# EAGLE design RB3200-ESP32universal (EAGLE 7.7.0)
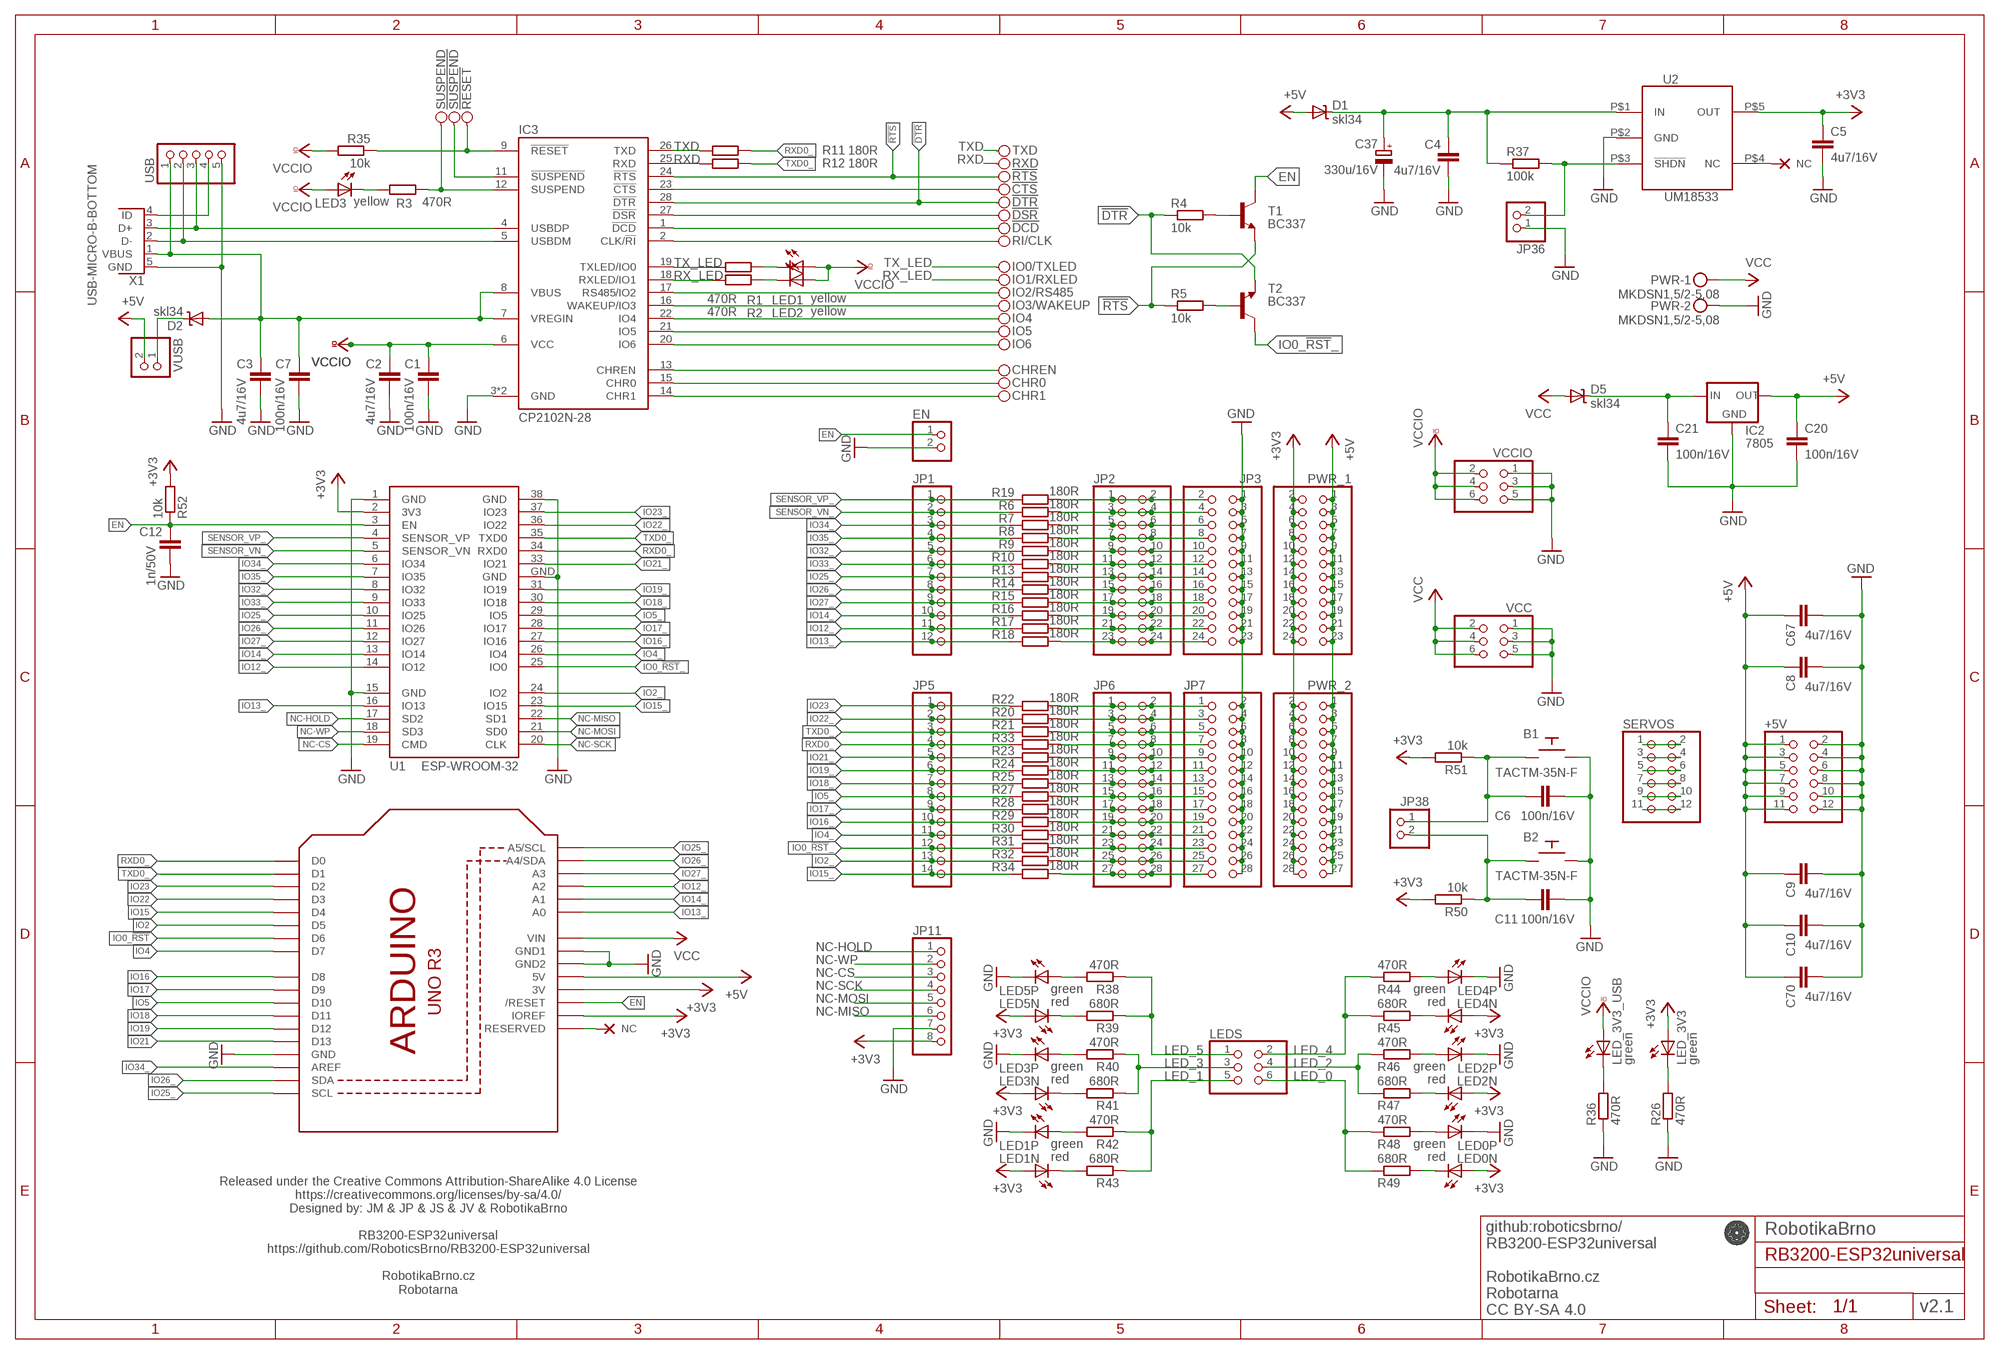
[diagram p0: schematic, sheet 1]

## Parts
!CTS  PINH1X01  [1X01]
!DCD  PINH1X01  [1X01]
!DSR  PINH1X01  [1X01]
!DTR  PINH1X01  [1X01]
!RESET  PINH1X01  [1X01]
!RTS  PINH1X01  [1X01]
!SUSPEND  PINH1X01  [1X01]
+5V  PINHD-2X6  [2X06]
B1  TACTM-35N-F  [TACTM-35N-F]
B2  TACTM-35N-F  [TACTM-35N-F]
C1  100n/16V  C-EUC0402  [C0402]
C2  4u7/16V  C-EUC0603  [C0603]
C3  4u7/16V  C-EUC0603  [C0603]
C4  4u7/16V  C-EUC0603  [C0603]
C5  4u7/16V  C-EUC0603  [C0603]
C6  100n/16V  C-EUC0402  [C0402]
C7  100n/16V  C-EUC0402  [C0402]
C8  4u7/16V  C-EUC0805  [C0805]
C9  4u7/16V  C-EUC0805  [C0805]
C10  4u7/16V  C-EUC0805  [C0805]
C11  100n/16V  C-EUC0402  [C0402]
C12  1n/50V  C-EUC0603  [C0603]
C20  100n/16V  C-EUC0402  [C0402]
C21  100n/16V  C-EUC0402  [C0402]
C37  330u/16V  CPOL-EUE5-10.5  [E5-10,5]
C67  4u7/16V  C-EUC0805  [C0805]
C70  4u7/16V  C-EUC0805  [C0805]
CHR0  PINH1X01  [1X01]
CHR1  PINH1X01  [1X01]
CHREN  PINH1X01  [1X01]
D1  skl34  SHOTTKY-SOD123  [SOD123]
D2  skl34  SHOTTKY-SOD123  [SOD123]
D5  skl34  SHOTTKY-SOD123  [SOD123]
EN  PINHD-1X2  [1X02]
IC2  7805  78XXS  [78XXS]
IC3  CP2102N-28  [QFN28-PAD]
IO0/TXLED  PINH1X01  [1X01]
IO1/RXLED  PINH1X01  [1X01]
IO2/RS485  PINH1X01  [1X01]
IO3/WAKEUP  PINH1X01  [1X01]
IO4  PINH1X01  [1X01]
IO5  PINH1X01  [1X01]
IO6  PINH1X01  [1X01]
JP1  PINHD-1X12  [1X12]
JP2  PINHD-2X12  [2X12]
JP3  PINHD-2X12  [2X12]
JP5  PINHD-1X14  [1X14]
JP6  PINHD-2X14  [2X14]
JP7  PINHD-2X14  [2X14]
JP11  PINHD-1X8  [1X08]
JP36  PINHD-1X2  [1X02]
JP38  PINHD-1X2  [1X02]
LED0N  red  LEDCHIPLED_0603  [CHIPLED_0603]
LED0P  green  LEDCHIPLED_0603  [CHIPLED_0603]
LED1  yellow  LEDCHIP-LED0603  [CHIP-LED0603]
LED1N  red  LEDCHIPLED_0603  [CHIPLED_0603]
LED1P  green  LEDCHIPLED_0603  [CHIPLED_0603]
LED2  yellow  LEDCHIP-LED0603  [CHIP-LED0603]
LED2N  red  LEDCHIPLED_0603  [CHIPLED_0603]
LED2P  green  LEDCHIPLED_0603  [CHIPLED_0603]
LED3  yellow  LEDCHIP-LED0603  [CHIP-LED0603]
LED3N  red  LEDCHIPLED_0603  [CHIPLED_0603]
LED3P  green  LEDCHIPLED_0603  [CHIPLED_0603]
LED4N  red  LEDCHIPLED_0603  [CHIPLED_0603]
LED4P  green  LEDCHIPLED_0603  [CHIPLED_0603]
LED5N  red  LEDCHIPLED_0603  [CHIPLED_0603]
LED5P  green  LEDCHIPLED_0603  [CHIPLED_0603]
LED_3V3  green  LEDCHIPLED_0603  [CHIPLED_0603]
LED_3V3_USB  green  LEDCHIPLED_0603  [CHIPLED_0603]
LEDS  PINHD-2X3  [2X03]
NC3  NC  (no package)
NC28  NC  (no package)
PWR  MKDSN1,5/2-5,08  [MKDSN1,5/2-5,08]
PWR_1  PINHD-2X12  [2X12]
PWR_2  PINHD-2X14  [2X14]
R1  470R  R-EU_R0603  [R0603]
R2  470R  R-EU_R0603  [R0603]
R3  470R  R-EU_R0603  [R0603]
R4  10k  R-EU_R0603  [R0603]
R5  10k  R-EU_R0603  [R0603]
R6  180R  R-EU_R0603  [R0603]
R7  180R  R-EU_R0603  [R0603]
R8  180R  R-EU_R0603  [R0603]
R9  180R  R-EU_R0603  [R0603]
R10  180R  R-EU_R0603  [R0603]
R11  180R  R-EU_R0603  [R0603]
R12  180R  R-EU_R0603  [R0603]
R13  180R  R-EU_R0603  [R0603]
R14  180R  R-EU_R0603  [R0603]
R15  180R  R-EU_R0603  [R0603]
R16  180R  R-EU_R0603  [R0603]
R17  180R  R-EU_R0603  [R0603]
R18  180R  R-EU_R0603  [R0603]
R19  180R  R-EU_R0603  [R0603]
R20  180R  R-EU_R0603  [R0603]
R21  180R  R-EU_R0603  [R0603]
R22  180R  R-EU_R0603  [R0603]
R23  180R  R-EU_R0603  [R0603]
R24  180R  R-EU_R0603  [R0603]
R25  180R  R-EU_R0603  [R0603]
R26  470R  R-EU_R0603  [R0603]
R27  180R  R-EU_R0603  [R0603]
R28  180R  R-EU_R0603  [R0603]
R29  180R  R-EU_R0603  [R0603]
R30  180R  R-EU_R0603  [R0603]
R31  180R  R-EU_R0603  [R0603]
R32  180R  R-EU_R0603  [R0603]
R33  180R  R-EU_R0603  [R0603]
R34  180R  R-EU_R0603  [R0603]
R35  10k  R-EU_R0603  [R0603]
R36  470R  R-EU_R0603  [R0603]
R37  100k  R-EU_R0603  [R0603]
R38  470R  R-EU_R0603  [R0603]
R39  680R  R-EU_R0603  [R0603]
R40  470R  R-EU_R0603  [R0603]
R41  680R  R-EU_R0603  [R0603]
R42  470R  R-EU_R0603  [R0603]
R43  680R  R-EU_R0603  [R0603]
R44  470R  R-EU_R0603  [R0603]
R45  680R  R-EU_R0603  [R0603]
R46  470R  R-EU_R0603  [R0603]
R47  680R  R-EU_R0603  [R0603]
R48  470R  R-EU_R0603  [R0603]
R49  680R  R-EU_R0603  [R0603]
R50  10k  R-EU_R0603  [R0603]
R51  10k  R-EU_R0603  [R0603]
R52  10k  R-EU_R0603  [R0603]
RI/CLK  PINH1X01  [1X01]
RXD  PINH1X01  [1X01]
SERVOS  PINHD-2X6  [2X06]
SUSPEND  PINH1X01  [1X01]
T1  BC337  NPN-SOT23-BEC  [SOT23]
T2  BC337  NPN-SOT23-BEC  [SOT23]
TXD  PINH1X01  [1X01]
U1  ESP-WROOM-32  [ESP-WROOM-32]
U2  UM18533  UM185XX  [SOT23-5]
U3  ARDUINOR3-BPLACE  [ARDUINOR3-BPLACE]
USB  PINHD-1X5  [1X05]
VCC  PINHD-2X3  [2X03]
VCCIO  PINHD-2X3  [2X03]
VUSB  PINHD-1X2  [1X02]
X1  USB-MICRO-B-BOTTOM  [USB-MICRO-B-BOTTOM-MOLEX]

## Nets
3V3_IN: C4.1 C37.+ D1.C R37.1 U2.P$1(IN)
5V_USB: D2.C VUSB.1
!DTR: !DTR.1 IC3.28(!DTR) R4.1 T2.2(E)
!DTR_B: R4.2 T1.1(B)
!RESET: !RESET.1 IC3.9(!RESET) R35.1
!RTS: !RTS.1 IC3.24(!RTS) R5.1 T1.2(E)
!RTS_B: R5.2 T2.1(B)
!SHDN: JP36.2 R37.2 U2.P$3(!SHDN)
!SUSPEND: !SUSPEND.1 IC3.11(!SUSPEND)
+3V3: C5.1 JP11.8 LED0N.A LED1N.A LED2N.A LED3N.A LED4N.A LED5N.A LED_3V3.A PWR_1.2 PWR_1.4 PWR_1.6 PWR_1.8 PWR_1.10 PWR_1.12 PWR_1.14 PWR_1.16 PWR_1.18 PWR_1.20 PWR_1.22 PWR_1.24 PWR_2.2 PWR_2.4 PWR_2.6 PWR_2.8 PWR_2.10 PWR_2.12 PWR_2.14 PWR_2.16 PWR_2.18 PWR_2.20 PWR_2.22 PWR_2.24 PWR_2.26 PWR_2.28 R50.2 R51.2 R52.2 U1.2(3V3) U2.P$5(OUT) U3.3V U3.IOREF
+5V: +5V.1 +5V.3 +5V.5 +5V.7 +5V.9 +5V.11 C8.1 C9.1 C10.1 C20.1 C67.1 C70.1 D1.A IC2.OUT PWR_1.1 PWR_1.3 PWR_1.5 PWR_1.7 PWR_1.9 PWR_1.11 PWR_1.13 PWR_1.15 PWR_1.17 PWR_1.19 PWR_1.21 PWR_1.23 PWR_2.1 PWR_2.3 PWR_2.5 PWR_2.7 PWR_2.9 PWR_2.11 PWR_2.13 PWR_2.15 PWR_2.17 PWR_2.19 PWR_2.21 PWR_2.23 PWR_2.25 PWR_2.27 U3.5V VUSB.2
BTN0: B1.P$4 C6.2 JP38.1 R51.1
BTN1: B2.P$4 C11.2 JP38.2 R50.1
CHR0: CHR0.1 IC3.15(CHR0)
CHR1: CHR1.1 IC3.14(CHR1)
CHREN: CHREN.1 IC3.13(CHREN)
CLK/!RI: IC3.2(CLK/!RI) RI/CLK.1
DCD: !DCD.1 IC3.1(!DCD)
DM: IC3.5(USBDM) USB.2 X1.2(D-)
DP: IC3.4(USBDP) USB.3 X1.3(D+)
DSR: !DSR.1 IC3.27(!DSR)
EN: C12.1 EN.1 R52.1 T1.3(C) U1.3(EN) U3.RESET(/RESET)
GND: +5V.2 +5V.4 +5V.6 +5V.8 +5V.10 +5V.12 B1.P$2 B2.P$2 C1.2 C2.2 C3.2 C4.2 C5.2 C6.1 C7.2 C8.2 C9.2 C10.2 C11.1 C12.2 C20.2 C21.2 C37.- C67.2 C70.2 EN.2 IC2.GND IC3.3(GND) IC3.PAD(GND) JP3.1 JP3.3 JP3.5 JP3.7 JP3.9 JP3.11 JP3.13 JP3.15 JP3.17 JP3.19 JP3.21 JP3.23 JP7.2 JP7.4 JP7.6 JP7.8 JP7.10 JP7.12 JP7.14 JP7.16 JP7.18 JP7.20 JP7.22 JP7.24 JP7.26 JP7.28 JP11.7 JP36.1 LED0P.C LED1P.C LED2P.C LED3P.C LED4P.C LED5P.C PWR.2 R26.1 R36.1 U1.1(GND) U1.15(GND) U1.38(GND) U1.GND U2.P$2(GND) U3.GND U3.GND1 U3.GND2 USB.5 VCC.1 VCC.3 VCC.5 VCCIO.1 VCCIO.3 VCCIO.5 X1.5(GND)
IO0_!RST: JP6.23 JP6.24 JP7.23 R31.1 U3.D6
IO0_!RST!_: JP5.12 R31.2 T2.3(C) U1.25(IO0)
IO2: JP6.25 JP6.26 JP7.25 R32.1 U3.D5
IO2_: JP5.13 R32.2 U1.24(IO2)
IO4: JP6.21 JP6.22 JP7.21 R30.1 U3.D7
IO4_: JP5.11 R30.2 U1.26(IO4)
IO5: JP6.15 JP6.16 JP7.15 R27.1 U3.D10
IO5_: JP5.8 R27.2 U1.29(IO5)
IO12: JP2.21 JP2.22 JP3.22 R17.1
IO12_: JP1.11 R17.2 U1.14(IO12) U3.A2
IO13: JP2.23 JP2.24 JP3.24 R18.1
IO13_: JP1.12 R18.2 U1.16(IO13) U3.A0
IO14: JP2.19 JP2.20 JP3.20 R16.1
IO14_: JP1.10 R16.2 U1.13(IO14) U3.A1
IO15: JP6.27 JP6.28 JP7.27 R34.1 U3.D4
IO15_: JP5.14 R34.2 U1.23(IO15)
IO16: JP6.19 JP6.20 JP7.19 R29.1 U3.D8
IO16_: JP5.10 R29.2 U1.27(IO16)
IO17: JP6.17 JP6.18 JP7.17 R28.1 U3.D9
IO17_: JP5.9 R28.2 U1.28(IO17)
IO18: JP6.13 JP6.14 JP7.13 R25.1 U3.D11
IO18_: JP5.7 R25.2 U1.30(IO18)
IO19: JP6.11 JP6.12 JP7.11 R24.1 U3.D12
IO19_: JP5.6 R24.2 U1.31(IO19)
IO21: JP6.9 JP6.10 JP7.9 R23.1 U3.D13
IO21_: JP5.5 R23.2 U1.33(IO21)
IO22: JP6.3 JP6.4 JP7.3 R20.1 U3.D3
IO22_: JP5.2 R20.2 U1.36(IO22)
IO23: JP6.1 JP6.2 JP7.1 R22.1 U3.D2
IO23_: JP5.1 R22.2 U1.37(IO23)
IO25: JP2.13 JP2.14 JP3.14 R13.1
IO25_: JP1.7 R13.2 U1.10(IO25) U3.A5(A5/SCL) U3.SCL
IO26: JP2.15 JP2.16 JP3.16 R14.1
IO26_: JP1.8 R14.2 U1.11(IO26) U3.A4(A4/SDA) U3.SDA
IO27: JP2.17 JP2.18 JP3.18 R15.1
IO27_: JP1.9 R15.2 U1.12(IO27) U3.A3
IO32: JP2.9 JP2.10 JP3.10 R9.1
IO32_: JP1.5 R9.2 U1.8(IO32)
IO33: JP2.11 JP2.12 JP3.12 R10.1
IO33_: JP1.6 R10.2 U1.9(IO33)
IO34: JP2.5 JP2.6 JP3.6 R7.1
IO34_: JP1.3 R7.2 U1.6(IO34) U3.AREF
IO35: JP2.7 JP2.8 JP3.8 R8.1
IO35_: JP1.4 R8.2 U1.7(IO35)
LED0N: LED0N.C R49.2
LED0P: LED0P.A R48.2
LED1N: LED1N.C R43.2
LED1P: LED1P.A R42.2
LED2N: LED2N.C R47.2
LED2P: LED2P.A R46.2
LED3N: LED3N.C R41.2
LED3P: LED3P.A R40.2
LED4N: LED4N.C R45.2
LED4P: LED4P.A R44.2
LED5N: LED5N.C R39.2
LED5P: LED5P.A R38.2
LED_0: LEDS.6 R48.1 R49.1
LED_1: LEDS.5 R42.1 R43.1
LED_2: LEDS.4 R46.1 R47.1
LED_3: LEDS.3 R40.1 R41.1
LED_3V3: LED_3V3.C R26.2
LED_3V3_USB: LED_3V3_USB.C R36.2
LED_4: LEDS.2 R44.1 R45.1
LED_5: LEDS.1 R38.1 R39.1
N$1: NC28.NC U3.RESERVED
N$2: !CTS.1 IC3.23(!CTS)
N$3: U3.VIN ; supply symbol labelled VCC
N$4: LED3.C R3.2
N$31: SERVOS.1 SERVOS.2
N$32: SERVOS.3 SERVOS.4
N$33: SERVOS.5 SERVOS.6
N$34: SERVOS.7 SERVOS.8
N$35: SERVOS.9 SERVOS.10
N$36: SERVOS.11 SERVOS.12
NC-CS: JP11.3 U1.19(CMD)
NC-HOLD: JP11.1 U1.17(SD2)
NC-MISO: JP11.6 U1.22(SD1)
NC-MOSI: JP11.5 U1.21(SD0)
NC-SCK: JP11.4 U1.20(CLK)
NC-WP: JP11.2 U1.18(SD3)
RX-LED: LED2.C R2.1
RX_LED: IC3.18(RXLED/IO1) IO1/RXLED.1 R2.2
RXD: IC3.25(RXD) R12.1 RXD.1
RXD0: JP6.7 JP6.8 JP7.7 R33.1 U3.D0
RXD0_: JP5.4 R11.2 R33.2 U1.34(RXD0)
SENSOR_VN: JP2.3 JP2.4 JP3.4 R6.1
SENSOR_VN_: JP1.2 R6.2 U1.5(SENSOR_VN)
SENSOR_VP: JP2.1 JP2.2 JP3.2 R19.1
SENSOR_VP_: JP1.1 R19.2 U1.4(SENSOR_VP)
SUSPEND: IC3.12(SUSPEND) R3.1 SUSPEND.1
TX-LED: LED1.C R1.1
TX_LED: IC3.19(TXLED/IO0) IO0/TXLED.1 R1.2
TXD: IC3.26(TXD) R11.1 TXD.1
TXD0: JP6.5 JP6.6 JP7.5 R21.1 U3.D1
TXD0_: JP5.3 R12.2 R21.2 U1.35(TXD0)
U2_NC: NC3.NC U2.P$4(NC)
USBID: USB.4 X1.4(ID)
USBIO3_RS485: IC3.17(RS485/IO2) IO2/RS485.1
USBIO3_WAKEUP: IC3.16(WAKEUP/IO3) IO3/WAKEUP.1
USBIO4: IC3.22(IO4) IO4.1
USBIO5: IC3.21(IO5) IO5.1
USBIO6: IC3.20(IO6) IO6.1
VCC: D5.A PWR.1 VCC.2 VCC.4 VCC.6
VCC->5V: C21.1 D5.C IC2.IN
VCCIO: C1.1 C2.1 IC3.6(VCC) LED1.A LED2.A LED3.A LED_3V3_USB.A R35.2 VCCIO.2 VCCIO.4 VCCIO.6
VUSB: C3.1 C7.1 D2.A IC3.7(VREGIN) IC3.8(VBUS) USB.1 X1.1(VBUS)

## Notes on the sheet
- Released under the Creative Commons Attribution-ShareAlike 4.0 License
  https://creativecommons.org/licenses/by-sa/4.0/
  Designed by: JM & JP & JS & JV & RobotikaBrno
  
  RB3200-ESP32universal
  https://github.com/RoboticsBrno/RB3200-ESP32universal
  
  RobotikaBrno.cz
  Robotarna
- RobotikaBrno
- v2.1
- github:roboticsbrno/
  RB3200-ESP32universal
  
  RobotikaBrno.cz
  Robotarna
  CC BY-SA 4.0

## Library data of the parts
!CTS !DCD !DSR !DTR !RESET !RTS !SUSPEND CHR0 CHR1 CHREN IO0/TXLED IO1/RXLED IO2/RS485 IO3/WAKEUP IO4-IO6 RI/CLK RXD SUSPEND TXD = pinhead_smd:PINH1X01; DIGIKEY: WM14724-ND; FARNELL: 1756963; MOUSER: 538-90120-0761; RS: 863-2706
+5V SERVOS = pinhead:PINHD-2X6: PIN HEADER; DIGIKEY: A122662-ND; FARNELL: 1248162; MOUSER: 571-826942-6; RS: 681-2953
B1 B2 = TACTM-35N-F:TACTM-35N-F; DIGIKEY: CKN1574TR-ND; FARNELL: 2079520; MOUSER: 611-PTS635SL43SMTRLF; RS: 135-9609
C1 C6 C7 C11 C20 C21 = rcl_upravena:C-EU: CAPACITOR, European symbol; DIGIKEY: 732-7478-1-ND; FARNELL: 2533923; MOUSER: 710-885012105001; RS: 788-2871
C2-C5 = rcl_upravena:C-EU: CAPACITOR, European symbol; DIGIKEY: 478-1253-1-ND; FARNELL: 9227784; MOUSER: 06034D475KAT2A; RS: 698-3248
C8-C10 C67 C70 = rcl_upravena:C-EU: CAPACITOR, European symbol; DIGIKEY: 1276-2970-1-ND; FARNELL: 2320854; MOUSER: 963-EMK212B7475KG-T; RS: 766-1037
C12 = rcl_upravena:C-EU: CAPACITOR, European symbol; DIGIKEY: 399-1082-1-ND; FARNELL: 1414608; MOUSER: 80-C0603C102K5R; RS: 264-4551
C37 = rcl_upravena:CPOL-EU: POLARIZED CAPACITOR, European symbol; DIGIKEY: 493-6629-1-ND; FARNELL: 9692045; MOUSER: 140-REA331M1CBK0811P; RS: 707-5840
D1 D2 D5 = diode:SHOTTKY
EN JP36 JP38 VUSB = pinhead:PINHD-1X2: PIN HEADER; DIGIKEY: 3M9457-02-ND; FARNELL: 2396217; MOUSER: 517-9611026404AR; RS: 827-7775
IC2 = v-reg:78XXS: VOLTAGE REGULATOR; DIGIKEY: 1016-1538-5-ND; FARNELL: 9756078; MOUSER: 701-SP7805V-L; RS: 769-5466
IC3 = CP2102N:CP2102N-28; DIGIKEY: 336-3694-ND; FARNELL: 2577279; MANUFACTURER: Silicon Labs; MOUSER: 634-CP2102NA01GQFN28; MPN: CP2102; RS: 526-8841
JP1 = pinhead:PINHD-1X12: PIN HEADER; DIGIKEY: WM50014-12-ND; FARNELL: 1593418; MOUSER: 538-22-28-4120; RS: 821-5689
JP2 JP3 PWR_1 = pinhead:PINHD-2X12: PIN HEADER; DIGIKEY: WM8148-ND; FARNELL: 9733663; MOUSER: 538-90131-0772; RS: 670-3500
JP5 = pinhead:PINHD-1X14: PIN HEADER; FARNELL: 2356164; MOUSER: 538-90120-0134; RS: 670-5060
JP6 JP7 PWR_2 = pinhead:PINHD-2X14: PIN HEADER; DIGIKEY: WM8150-ND; FARNELL: 2356142; MOUSER: 538-90131-0774; RS: 670-3512
JP11 = pinhead:PINHD-1X8: PIN HEADER; DIGIKEY: A122911-ND; FARNELL: 1248147; MOUSER: 571-826926-8; RS: 669-5339
LED0N LED1N LED2N LED3N LED4N LED5N = led:LED: LED OSRAM: - CHIPLED LG R971, LG N971, LY N971, LG Q971, LY Q971, LO R971, LY R971 LH N974, LH R974 LS Q976, LO Q976, LY Q976 LO Q996 - Hyper CHIPLED LW Q18S LB Q993, LB Q99A, LB R99A - SideLED LS A670, LO A670, LY A670, LG A670, LP A670 LB A673, LV A673, LT A673, LW A673 LH A674 LY A675 LS A676, LA A676, LO A676, LY A676, LW A676 LS A679, LY A679, LG A679 - Hyper Micro SIDELED® LS Y876, LA Y876, LO Y876, LY Y876 LT Y87S - SmartLED LW L88C, LW L88S LB L89C, LB L89S, LG L890 LS L89K, LO L89K, LY L89K LS L896, LA L896, LO L896, LY L896 - TOPLED LS T670, LO T670, LY T670, LG T670, LP T670 LSG T670, LSP T670, LSY T670, LOP T670, LYG T670 LG T671, LOG T671, LSG T671 LB T673, LV T673, LT T673, LW T673 LH T674 LS T676, LA T676, LO T676, LY T676, LB T676, LH T676, LSB T676, LW T676 LB T67C, LV T67C, LT T67C, LS T67K, LO T67K, LY T67K, LW E67C LS E67B, LA E67B, LO E67B, LY E67B, LB E67C, LV E67C, LT E67C LW T67C LS T679, LY T679, LG T679 LS T770, LO T770, LY T770, LG T770, LP T770 LB T773, LV T773, LT T773, LW T773 LH T774 LS E675, LA E675, LY E675, LS T675 LS T776, LA T776, LO T776, LY T776, LB T776 LHGB T686 LT T68C, LB T68C - Hyper Mini TOPLED® LB M676 - Mini TOPLED Santana® LG M470 LS M47K, LO M47K, LY M47K Source: http://www.osram.convergy.de LUXEON: - LUMILED® LXK2-PW12-R00, LXK2-PW12-S00, LXK2-PW14-U00, LXK2-PW14-V00 LXK2-PM12-R00, LXK2-PM12-S00, LXK2-PM14-U00 LXK2-PE12-Q00, LXK2-PE12-R00, LXK2-PE12-S00, LXK2-PE14-T00, LXK2-PE14-U00 LXK2-PB12-K00, LXK2-PB12-L00, LXK2-PB12-M00, LXK2-PB14-N00, LXK2-PB14-P00, LXK2-PB14-Q00 LXK2-PR12-L00, LXK2-PR12-M00, LXK2-PR14-Q00, LXK2-PR14-R00 LXK2-PD12-Q00, LXK2-PD12-R00, LXK2-PD12-S00 LXK2-PH12-R00, LXK2-PH12-S00 LXK2-PL12-P00, LXK2-PL12-Q00, LXK2-PL12-R00 Source: www.luxeon.com KINGBRIGHT: KA-3528ASYC Source: www.kingbright.com; DIGIKEY: 160-1447-1-ND; FARNELL: 2322071; MOUSER: 859-LTST-C191KRKT; RS: 127-8415
LED0P LED1P LED2P LED3P LED4P LED5P LED_3V3 LED_3V3_USB = led:LED: LED OSRAM: - CHIPLED LG R971, LG N971, LY N971, LG Q971, LY Q971, LO R971, LY R971 LH N974, LH R974 LS Q976, LO Q976, LY Q976 LO Q996 - Hyper CHIPLED LW Q18S LB Q993, LB Q99A, LB R99A - SideLED LS A670, LO A670, LY A670, LG A670, LP A670 LB A673, LV A673, LT A673, LW A673 LH A674 LY A675 LS A676, LA A676, LO A676, LY A676, LW A676 LS A679, LY A679, LG A679 - Hyper Micro SIDELED® LS Y876, LA Y876, LO Y876, LY Y876 LT Y87S - SmartLED LW L88C, LW L88S LB L89C, LB L89S, LG L890 LS L89K, LO L89K, LY L89K LS L896, LA L896, LO L896, LY L896 - TOPLED LS T670, LO T670, LY T670, LG T670, LP T670 LSG T670, LSP T670, LSY T670, LOP T670, LYG T670 LG T671, LOG T671, LSG T671 LB T673, LV T673, LT T673, LW T673 LH T674 LS T676, LA T676, LO T676, LY T676, LB T676, LH T676, LSB T676, LW T676 LB T67C, LV T67C, LT T67C, LS T67K, LO T67K, LY T67K, LW E67C LS E67B, LA E67B, LO E67B, LY E67B, LB E67C, LV E67C, LT E67C LW T67C LS T679, LY T679, LG T679 LS T770, LO T770, LY T770, LG T770, LP T770 LB T773, LV T773, LT T773, LW T773 LH T774 LS E675, LA E675, LY E675, LS T675 LS T776, LA T776, LO T776, LY T776, LB T776 LHGB T686 LT T68C, LB T68C - Hyper Mini TOPLED® LB M676 - Mini TOPLED Santana® LG M470 LS M47K, LO M47K, LY M47K Source: http://www.osram.convergy.de LUXEON: - LUMILED® LXK2-PW12-R00, LXK2-PW12-S00, LXK2-PW14-U00, LXK2-PW14-V00 LXK2-PM12-R00, LXK2-PM12-S00, LXK2-PM14-U00 LXK2-PE12-Q00, LXK2-PE12-R00, LXK2-PE12-S00, LXK2-PE14-T00, LXK2-PE14-U00 LXK2-PB12-K00, LXK2-PB12-L00, LXK2-PB12-M00, LXK2-PB14-N00, LXK2-PB14-P00, LXK2-PB14-Q00 LXK2-PR12-L00, LXK2-PR12-M00, LXK2-PR14-Q00, LXK2-PR14-R00 LXK2-PD12-Q00, LXK2-PD12-R00, LXK2-PD12-S00 LXK2-PH12-R00, LXK2-PH12-S00 LXK2-PL12-P00, LXK2-PL12-Q00, LXK2-PL12-R00 Source: www.luxeon.com KINGBRIGHT: KA-3528ASYC Source: www.kingbright.com; DIGIKEY: 160-1446-1-ND; FARNELL: 2293494; MOUSER: 859-LTST-C191KGKT; RS: 872-1799
LED1-LED3 = led:LED: LED OSRAM: - CHIPLED LG R971, LG N971, LY N971, LG Q971, LY Q971, LO R971, LY R971 LH N974, LH R974 LS Q976, LO Q976, LY Q976 LO Q996 - Hyper CHIPLED LW Q18S LB Q993, LB Q99A, LB R99A - SideLED LS A670, LO A670, LY A670, LG A670, LP A670 LB A673, LV A673, LT A673, LW A673 LH A674 LY A675 LS A676, LA A676, LO A676, LY A676, LW A676 LS A679, LY A679, LG A679 - Hyper Micro SIDELED® LS Y876, LA Y876, LO Y876, LY Y876 LT Y87S - SmartLED LW L88C, LW L88S LB L89C, LB L89S, LG L890 LS L89K, LO L89K, LY L89K LS L896, LA L896, LO L896, LY L896 - TOPLED LS T670, LO T670, LY T670, LG T670, LP T670 LSG T670, LSP T670, LSY T670, LOP T670, LYG T670 LG T671, LOG T671, LSG T671 LB T673, LV T673, LT T673, LW T673 LH T674 LS T676, LA T676, LO T676, LY T676, LB T676, LH T676, LSB T676, LW T676 LB T67C, LV T67C, LT T67C, LS T67K, LO T67K, LY T67K, LW E67C LS E67B, LA E67B, LO E67B, LY E67B, LB E67C, LV E67C, LT E67C LW T67C LS T679, LY T679, LG T679 LS T770, LO T770, LY T770, LG T770, LP T770 LB T773, LV T773, LT T773, LW T773 LH T774 LS E675, LA E675, LY E675, LS T675 LS T776, LA T776, LO T776, LY T776, LB T776 LHGB T686 LT T68C, LB T68C - Hyper Mini TOPLED® LB M676 - Mini TOPLED Santana® LG M470 LS M47K, LO M47K, LY M47K Source: http://www.osram.convergy.de LUXEON: - LUMILED® LXK2-PW12-R00, LXK2-PW12-S00, LXK2-PW14-U00, LXK2-PW14-V00 LXK2-PM12-R00, LXK2-PM12-S00, LXK2-PM14-U00 LXK2-PE12-Q00, LXK2-PE12-R00, LXK2-PE12-S00, LXK2-PE14-T00, LXK2-PE14-U00 LXK2-PB12-K00, LXK2-PB12-L00, LXK2-PB12-M00, LXK2-PB14-N00, LXK2-PB14-P00, LXK2-PB14-Q00 LXK2-PR12-L00, LXK2-PR12-M00, LXK2-PR14-Q00, LXK2-PR14-R00 LXK2-PD12-Q00, LXK2-PD12-R00, LXK2-PD12-S00 LXK2-PH12-R00, LXK2-PH12-S00 LXK2-PL12-P00, LXK2-PL12-Q00, LXK2-PL12-R00 Source: www.luxeon.com KINGBRIGHT: KA-3528ASYC Source: www.kingbright.com; DIGIKEY: 732-4981-1-ND; FARNELL: 2322074; MOUSER: 710-150060YS75000; RS: 815-4219
LEDS VCC VCCIO = pinhead:PINHD-2X3: PIN HEADER; DIGIKEY: A122915-ND; FARNELL: 1248159; MOUSER: 571-826942-3; RS: 360-6443
NC3 NC28 = NC:NC: _EXTERNAL_
PWR = con-phoenix-508:MKDSN1,5/2-5,08: MKDSN 1,5/ 2-5,08 Printklemme Nennstrom: 13,5 A Nennspannung: 250 V Rastermaß: 5,08 mm Polzahl: 2 Anschlussart: Schraubanschluss Montage: Löten Anschlussrichtung Leiter/Platine: 0 ° Artikelnummer: 1729128 Source: http://eshop.phoenixcontact.com .. 1729128.pdf; DIGIKEY: 277-5953-ND; FARNELL: 2490945; MOUSER: 651-1890963; RS: 804-5118
R1-R3 R26 R36 R38 R40 R42 R44 R46 R48 = rcl_upravena:R-EU_: RESISTOR, European symbol; DIGIKEY: 311-470HRCT-ND; FARNELL: 9238441; MOUSER: 603-RC0603FR-07470RL; RS: 566-547
R4 R5 R35 R50-R52 = rcl_upravena:R-EU_: RESISTOR, European symbol; DIGIKEY: 311-10KGRCT-ND; FARNELL: 9238603; MOUSER: 603-RC0603FR-0710KL; RS: 213-2418
R6-R25 R27-R34 = rcl_upravena:R-EU_: RESISTOR, European symbol; DIGIKEY: 311-180HRCT-ND; FARNELL: 9238395; MOUSER: 603-RC0603FR-07180RL; RS: 566-412
R37 = rcl_upravena:R-EU_: RESISTOR, European symbol; DIGIKEY: 311-100KHRCT-ND; FARNELL: 9238727; MOUSER: 603-RC0603FR-07100KL; RS: 566-787
R39 R41 R43 R45 R47 R49 = rcl_upravena:R-EU_: RESISTOR, European symbol; DIGIKEY: 311-680HRCT-ND; FARNELL: 9238468; MOUSER: 603-RC0603FR-13680RL
T1 T2 = transistors:NPN; DIGIKEY: 1727-2919-1-ND; FARNELL: 1081224; MOUSER: 771-BC817-40-T/R; RS: 216-9410
U1 = esp32:ESP-WROOM-32: Espressif Systems ESP-WROOM-32; DIGIKEY: 1738-1294-ND; MANUFACTURER: Espressif Systems; MPN: ESP32-WROMM-32
U2 = um185xx:UM185XX; DIGIKEY: 296-17580-1-ND; FARNELL: 1135395; MANUFACTURER: Texas Instruments; MOUSER: 595-TPS73033DBVR; MPN: TPS73033DBVT; RS: 620-1401
U3 = adafruit:ARDUINOR3: This is a new object for the new Arduino R3 - with extra pins that you may want to use (such as IOref, and duplicated A4/A5
USB = pinhead:PINHD-1X5: PIN HEADER; DIGIKEY: 732-5318-ND; FARNELL: 2356157; MOUSER: 710-61300511121; RS: 828-1597
X1 = usb:USB; DIGIKEY: WM17141CT-ND; FARNELL: 1568026; MOUSER: 538-47346-0001; RS: 702-5475

## Board
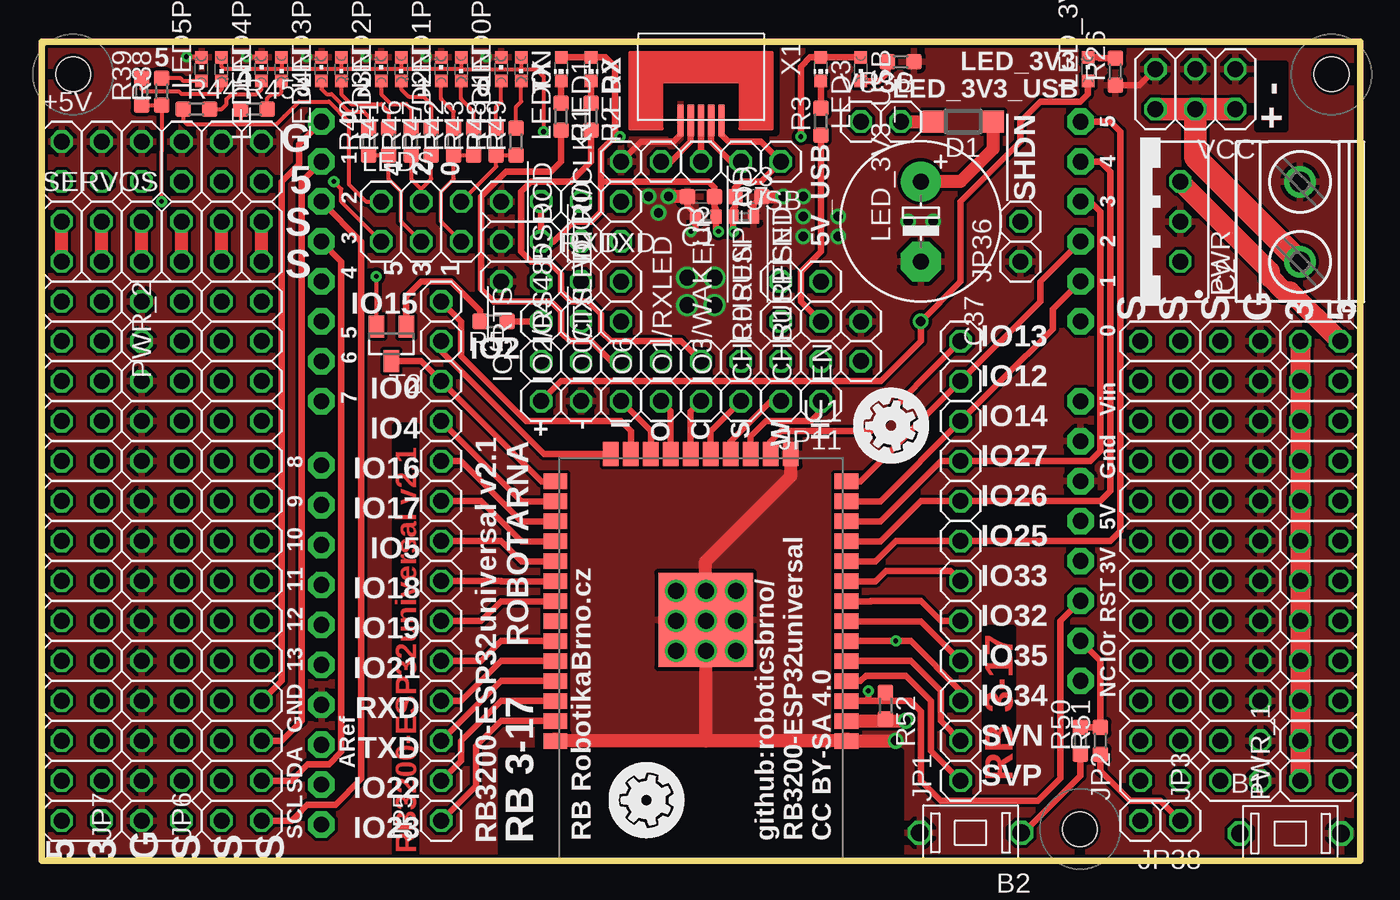
[diagram p1: board, top side]
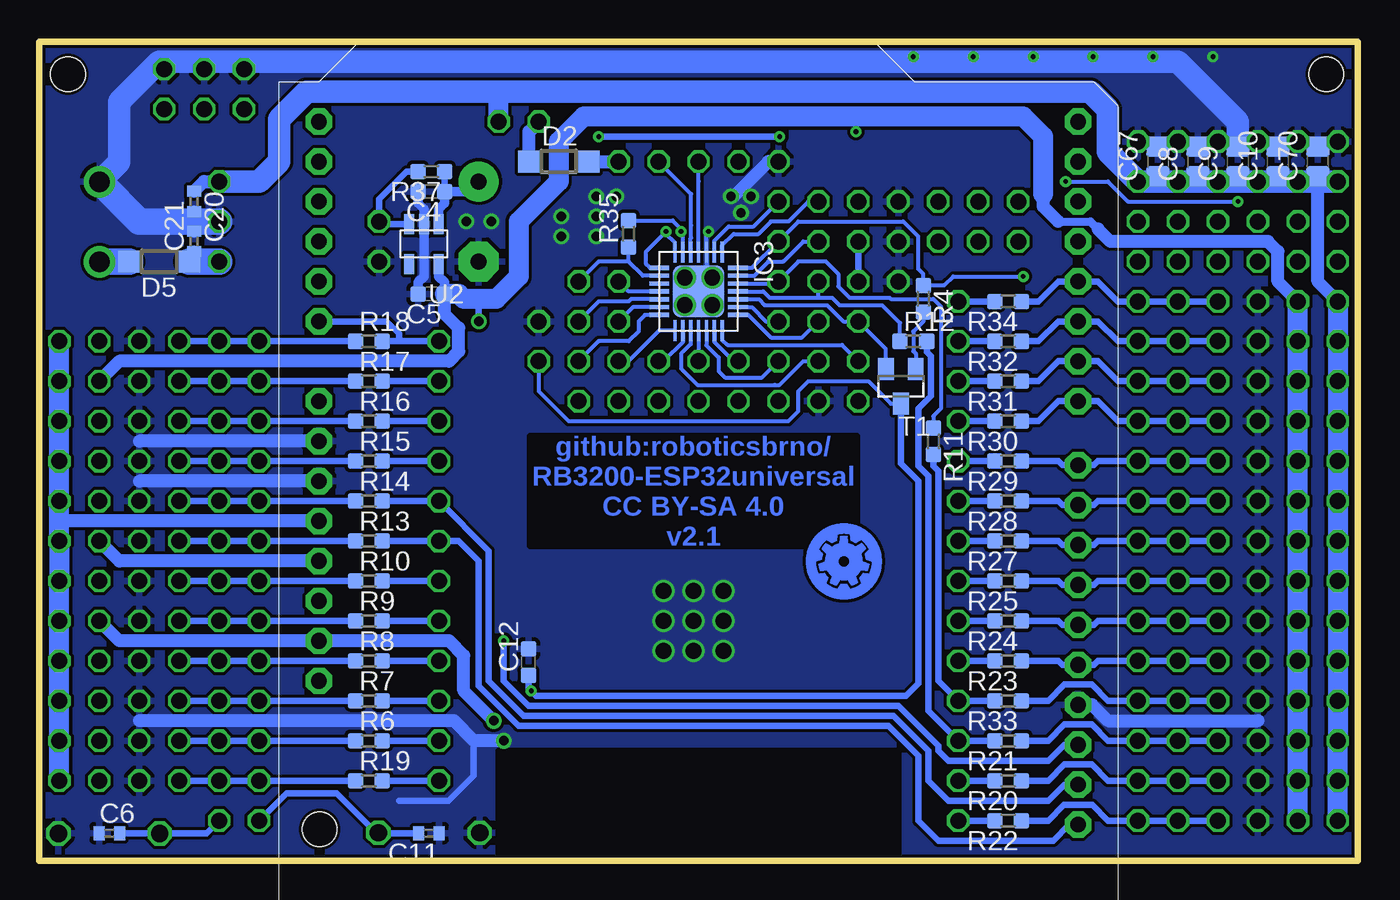
[diagram p2: board, bottom side, seen from below]

Size 83.82 x 52.07 mm. Coordinates in mm from the lower left corner, seen from the top.
Outline: 0,0 83.82,0 83.82,52.07 0,52.06 0,0
Copper layers (1*16): Top 0.035mm / dielectric 1.5mm / Bottom 0.035mm
Design rules "gatema_2layers": minimum track width 0.15mm, minimum drill 0.3mm, track to track 0.15mm, track to pad 0.15mm, pad to pad 0.15mm, via to via 0.15mm, smd to smd 0mil, copper to edge 0.15mm, drill to drill 0.4mm, minimum pad ring 0.2mm, minimum via ring 0.2mm, stop-mask expansion 2mil, vias tented up to drill 0.4mm, thermal gap 10mil
Holes 2.2 mm at 66,2 2,50 82,50
tRestrict: area 29.2,0 to 54.6,7; 2 lines
bRestrict: area 29.2,0 to 54.6,7; 1 lines

### Footprints (pad centres in the part's own frame; a part is rotated, then mirrored left to right if it is on the bottom)
1X01 = drill 1.016 octagon: 1 0,0
2X06 = drill 1.016 octagon: 1 -6.35,-1.27; 2 -6.35,1.27; 3 -3.81,-1.27; 4 -3.81,1.27; 5 -1.27,-1.27; 6 -1.27,1.27; 7 1.27,-1.27; 8 1.27,1.27; 9 3.81,-1.27; 10 3.81,1.27; 11 6.35,-1.27; 12 6.35,1.27
TACTM-35N-F = drill 1.1 octagon: P$2 3.231,-0.02; P$4 -3.204,-0.02
C0402 = smd 0.7 x 0.9: 1 -0.65,0; 2 0.65,0
C0603 = smd 1 x 1: 1 -0.85,0; 2 0.85,0
C0805 = smd 1.3 x 1.5: 1 -0.95,0; 2 0.95,0
E5-10,5 = drill 1.016 pad 2.54: + -2.54,0 | drill 1.016 pad 2.54 octagon: - 2.54,0
SOD123 = smd 1.4 x 1.4: A 1.9,0; C -1.9,0
1X02 = drill 1.016 octagon: 1 -1.27,0; 2 1.27,0
78XXS = drill 1.016 octagon: GND 0,-2.54; IN -2.54,-2.54; OUT 2.54,-2.54
QFN28-PAD = smd 1.3 x 0.25: 1 -2.5,1.5; 2 -2.5,1; 3 -2.5,0.5; 4 -2.5,0; 5 -2.5,-0.5; 6 -2.5,-1; 7 -2.5,-1.5; 15 2.5,-1.5; 16 2.5,-1; 17 2.5,-0.5; 18 2.5,0; 19 2.5,0.5; 20 2.5,1; 21 2.5,1.5 | smd 0.25 x 1.3: 8 -1.5,-2.5; 9 -1,-2.5; 10 -0.5,-2.5; 11 0,-2.5; 12 0.5,-2.5; 13 1,-2.5; 14 1.5,-2.5; 22 1.5,2.5; 23 1,2.5; 24 0.5,2.5; 25 0,2.5; 26 -0.5,2.5; 27 -1,2.5; 28 -1.5,2.5 | smd 3.3 x 3.3: PAD 0,0
1X12 = drill 1.016 octagon: 1 -13.97,0; 2 -11.43,0; 3 -8.89,0; 4 -6.35,0; 5 -3.81,0; 6 -1.27,0; 7 1.27,0; 8 3.81,0; 9 6.35,0; 10 8.89,0; 11 11.43,0; 12 13.97,0
2X12 = drill 1.016 octagon: 1 -13.97,-1.27; 2 -13.97,1.27; 3 -11.43,-1.27; 4 -11.43,1.27; 5 -8.89,-1.27; 6 -8.89,1.27; 7 -6.35,-1.27; 8 -6.35,1.27; 9 -3.81,-1.27; 10 -3.81,1.27; 11 -1.27,-1.27; 12 -1.27,1.27; 13 1.27,-1.27; 14 1.27,1.27; 15 3.81,-1.27; 16 3.81,1.27; 17 6.35,-1.27; 18 6.35,1.27; 19 8.89,-1.27; 20 8.89,1.27; 21 11.43,-1.27; 22 11.43,1.27; 23 13.97,-1.27; 24 13.97,1.27
1X14 = drill 1.016 octagon: 1 -16.51,0; 2 -13.97,0; 3 -11.43,0; 4 -8.89,0; 5 -6.35,0; 6 -3.81,0; 7 -1.27,0; 8 1.27,0; 9 3.81,0; 10 6.35,0; 11 8.89,0; 12 11.43,0; 13 13.97,0; 14 16.51,0
2X14 = drill 1.016 octagon: 1 -16.51,-1.27; 2 -16.51,1.27; 3 -13.97,-1.27; 4 -13.97,1.27; 5 -11.43,-1.27; 6 -11.43,1.27; 7 -8.89,-1.27; 8 -8.89,1.27; 9 -6.35,-1.27; 10 -6.35,1.27; 11 -3.81,-1.27; 12 -3.81,1.27; 13 -1.27,-1.27; 14 -1.27,1.27; 15 1.27,-1.27; 16 1.27,1.27; 17 3.81,-1.27; 18 3.81,1.27; 19 6.35,-1.27; 20 6.35,1.27; 21 8.89,-1.27; 22 8.89,1.27; 23 11.43,-1.27; 24 11.43,1.27; 25 13.97,-1.27; 26 13.97,1.27; 27 16.51,-1.27; 28 16.51,1.27
1X08 = drill 1.016 octagon: 1 -8.89,0; 2 -6.35,0; 3 -3.81,0; 4 -1.27,0; 5 1.27,0; 6 3.81,0; 7 6.35,0; 8 8.89,0
CHIPLED_0603 = smd 0.8 x 0.8: A 0,-0.75; C 0,0.75
CHIP-LED0603 = smd 0.8 x 0.8: A 0,-0.75; C 0,0.75
2X03 = drill 1.016 octagon: 1 -2.54,-1.27; 2 -2.54,1.27; 3 0,-1.27; 4 0,1.27; 5 2.54,-1.27; 6 2.54,1.27
MKDSN1,5/2-5,08 = drill 1.3 pad 2: 1 -2.561,0.025; 2 2.519,0.025
R0603 = smd 1 x 1: 1 -0.85,0; 2 0.85,0
SOT23 = smd 1 x 1.4: 1 -0.95,-1.1; 2 0.95,-1.1; 3 0,1.1
ESP-WROOM-32 = smd 1.5 x 1: 1 -9.25,7; 2 -9.25,5.73; 3 -9.25,4.46; 4 -9.25,3.19; 5 -9.25,1.92; 6 -9.25,0.65; 7 -9.25,-0.62; 8 -9.25,-1.89; 9 -9.25,-3.16; 10 -9.25,-4.43; 11 -9.25,-5.7; 12 -9.25,-6.97; 13 -9.25,-8.24; 14 -9.25,-9.51; 25 9.25,-9.51; 26 9.25,-8.24; 27 9.25,-6.97; 28 9.25,-5.7; 29 9.25,-4.43; 30 9.25,-3.16; 31 9.25,-1.89; 32 9.25,-0.62; 33 9.25,0.65; 34 9.25,1.92; 35 9.25,3.19; 36 9.25,4.46; 37 9.25,5.73; 38 9.25,7 | smd 1 x 1.5: 15 -5.7,-11.25; 16 -4.43,-11.25; 17 -3.16,-11.25; 18 -1.89,-11.25; 19 -0.62,-11.25; 20 0.65,-11.25; 21 1.92,-11.25; 22 3.19,-11.25; 23 4.46,-11.25; 24 5.73,-11.25 | smd 6 x 6: GND -0.3,-0.7
SOT23-5 = smd 0.635 x 1.27: P$1 -0.95,-1.27; P$2 0,-1.27; P$3 0.95,-1.27; P$4 0.95,1.27; P$5 -0.95,1.27
ARDUINOR3-BPLACE = drill 1 pad 1.676 octagon: 3V 35.56,2.54; 5V 38.1,2.54; A0 50.8,2.54; A1 53.34,2.54; A2 55.88,2.54; A3 58.42,2.54; A4 60.96,2.54; A5 63.5,2.54; AREF 23.876,50.8; D0 63.5,50.8; D1 60.96,50.8; D2 58.42,50.8; D3 55.88,50.8; D4 53.34,50.8; D5 50.8,50.8; D6 48.26,50.8; D7 45.72,50.8; D8 41.656,50.8; D9 39.116,50.8; D10 36.576,50.8; D11 34.036,50.8; D12 31.496,50.8; D13 28.956,50.8; GND 26.416,50.8; GND1 43.18,2.54; GND2 40.64,2.54; IOREF 30.48,2.54; RESERVED 27.94,2.54; RESET 33.02,2.54; SCL 18.796,50.8; SDA 21.336,50.8; VIN 45.72,2.54
1X05 = drill 1.016 octagon: 1 -5.08,0; 2 -2.54,0; 3 0,0; 4 2.54,0; 5 5.08,0
USB-MICRO-B-BOTTOM-MOLEX = smd 2 x 0.4: 1 5,1.3; 2 5,0.65; 3 5,0; 4 5,-0.65; 5 5,-1.3

### Placement (x,y rotation side)
!CTS  36.83,34.29 90 top
!DCD  34.29,41.91 90 top
!DSR  34.29,39.37 90 top
!DTR  36.83,39.37 90 top
!RESET  49.53,36.83 90 top
!RTS  31.75,34.29 90 top
!SUSPEND  46.99,36.83 90 top
+5V  7.62,44.45 0 top
B1  79.38,1.75 0 top
B2  59.05,1.75 180 top
C1  42.23,40.96 180 top
C2  41.91,42.23 180 top
C3  44.93,42.23 0 top
C4  58.9,42.55 180 bottom
C5  58.9,36.04 180 bottom
C6  79.38,1.75 0 bottom
C7  44.61,40.96 0 top
C8  10.16,44.45 90 bottom
C9  7.62,44.45 90 bottom
C10  5.08,44.45 90 bottom
C11  59.05,1.75 180 bottom
C12  52.72,12.62 90 bottom
C20  73.98,41.91 270 bottom
C21  73.98,39.37 90 bottom
C37  55.88,40.64 270 top
C67  12.7,44.45 90 bottom
C70  2.54,44.45 90 bottom
CHR0  46.99,31.75 90 top
CHR1  49.53,31.75 90 top
CHREN  46.99,34.29 90 top
D1  58.58,46.99 180 top
D2  50.8,44.45 0 bottom
D5  76.2,38.1 180 bottom
EN  52.07,33.02 90 top
IC2  69.85,40.64 90 top
IC3  41.91,36.2 270 bottom
IO0/TXLED  36.83,31.75 90 top
IO1/RXLED  41.91,31.75 90 top
IO2/RS485  34.29,31.75 90 top
IO3/WAKEUP  44.45,31.75 90 top
IO4  34.29,34.29 90 top
IO5  31.75,31.75 90 top
IO6  39.37,31.75 90 top
JP1  58.42,19.05 90 top
JP2  71.12,19.05 90 top
JP3  76.2,19.05 90 top
JP5  25.4,19.05 90 top
JP6  12.7,19.05 90 top
JP7  7.62,19.05 90 top
JP11  40.64,29.21 180 top
JP36  62.23,39.37 90 top
JP38  71.12,2.54 180 top
LED0N  30.48,50.32 180 top
LED0P  29.21,50.32 0 top
LED1  33.02,50.32 180 top
LED1N  26.67,50.32 180 top
LED1P  25.4,50.32 0 top
LED2  34.92,50.32 180 top
LED2N  22.86,50.32 180 top
LED2P  21.59,50.32 0 top
LED3  49.53,50.32 180 top
LED3N  19.05,50.32 180 top
LED3P  17.78,50.32 0 top
LED4N  15.24,50.32 180 top
LED4P  13.97,50.32 0 top
LED5N  11.43,50.32 180 top
LED5P  10.16,50.32 0 top
LED_3V3  66.52,50.32 0 top
LED_3V3_USB  52.07,50.32 180 top
LEDS  24.13,40.64 0 top
PWR  80.01,40.64 90 top
PWR_1  81.28,19.05 90 top
PWR_2  2.54,19.05 270 top
R1  33.02,47.31 270 top
R2  34.92,47.31 270 top
R3  49.53,46.99 90 top
R4  27.62,35.72 270 bottom
R5  28.73,34.29 180 top
R6  62.87,7.62 0 bottom
R7  62.87,10.16 0 bottom
R8  62.87,12.7 0 bottom
R9  62.87,15.24 0 bottom
R10  62.87,17.78 0 bottom
R11  26.99,26.67 270 bottom
R12  28.26,33.02 0 bottom
R13  62.87,20.32 0 bottom
R14  62.87,22.86 0 bottom
R15  62.87,25.4 0 bottom
R16  62.87,27.94 0 bottom
R17  62.87,30.48 0 bottom
R18  62.87,33.02 0 bottom
R19  62.87,5.08 0 bottom
R20  22.23,5.08 180 bottom
R21  22.23,7.62 180 bottom
R22  22.23,2.54 180 bottom
R23  22.23,12.7 180 bottom
R24  22.23,15.24 180 bottom
R25  22.23,17.78 180 bottom
R26  68.26,50.16 90 top
R27  22.23,20.32 180 bottom
R28  22.23,22.86 180 bottom
R29  22.23,25.4 180 bottom
R30  22.23,27.94 180 bottom
R31  22.23,30.48 180 bottom
R32  22.23,33.02 180 bottom
R33  22.23,10.16 180 bottom
R34  22.23,35.56 180 bottom
R35  46.35,39.85 90 bottom
R36  54.61,50.8 180 top
R37  58.9,43.81 180 bottom
R38  7.62,48.9 90 top
R39  6.35,48.9 90 top
R40  20.8,45.72 90 top
R41  22.07,45.72 90 top
R42  26.19,45.72 90 top
R43  27.46,45.72 90 top
R44  9.84,47.78 0 top
R45  13.49,47.78 0 top
R46  23.5,45.72 90 top
R47  24.77,45.72 90 top
R48  28.89,45.72 90 top
R49  30.16,45.72 90 top
R50  66.04,7.62 90 top
R51  67.31,7.62 90 top
R52  53.65,9.85 270 top
RI/CLK  36.83,41.91 90 top
RXD  34.29,36.83 0 top
SERVOS  7.62,39.37 0 top
SUSPEND  49.53,34.29 90 top
T1  29.05,30.16 180 bottom
T2  22.23,32.86 180 top
TXD  36.83,36.83 0 top
U1  41.91,14.61 180 top
U2  59.37,39.21 180 bottom
U3  68.58,-16.51 90 top
USB  41.91,44.45 180 top
VCC  73.34,49.05 180 top
VCCIO  30.48,39.37 270 top
VUSB  53.34,46.99 0 top
X1  41.91,52.07 270 top

### Tracks (layer width: path | path; a pad name or v marks a point on that pad's centre or on a via)
3V3_IN
  Top 0.813: D1.C 60.48,45.24 58.42,43.18 C37.+
  Bottom 0.406: R37.1 C4.1
  Bottom 0.61: U2.P$1 58.42,41.43 58.05,41.81 C4.1 56.52,42.55 C37.+
5V_USB
  Bottom 0.813: D2.C 52.7,46.36 VUSB.1
!DTR  (via drill 0.3)
  Top 0.254: v21.27,37.15 | T2.2 v21.27,37.15
  Bottom 0.254: IC3.28 38.51,37.7 !DTR.1 35.56,40.64 28.89,40.64 27.94,39.69 27.94,37.62 27.62,37.31 R4.1 26.3,36.57 25.72,37.15 v21.27,37.15
!DTR_B
  Bottom 0.254: R4.2 27.62,34.29 28.26,33.66 28.26,32.38 28.1,32.23 T1.1
!RESET
  Bottom 0.254: IC3.9 45.45,37.2 46.35,38.1 | 46.35,38.1 R35.1 | 46.35,38.1 48.26,38.1 !RESET.1
!RTS
  Top 0.406: R5.1 !RTS.1
  Bottom 0.254: IC3.24 38.08,35.7 37.7,35.32 33.73,35.32 32.7,34.29 !RTS.1 30,32.54 T1.2
!RTS_B
  Top 0.406: R5.2 27.88,34.98 26.04,36.83 24.13,36.83 23.18,35.88 T2.1
!SHDN
  Bottom 0.406: U2.P$3 62.07,40.48 JP36.2 62.23,42.07 60.8,43.5 60.48,43.81 R37.2
!SUSPEND
  Bottom 0.254: IC3.11 46.35,36.2 !SUSPEND.1
+3V3  (via drill 0.3, 0.6)
  Top 0.254: 30.48,50.32 31.43,50.32 31.91,49.85 v31.91,46.35 | 26.67,50.32 22.86,50.32 | 22.86,50.32 19.05,50.32 | 19.05,50.32 15.24,50.32 | 15.24,50.32 11.59,50.32 11.43,50.48 LED5N.A | LED4N.A 15.24,50.32 | 26.67,50.32 30.48,50.32 | LED3N.A 19.05,50.32 | LED2N.A 22.86,50.32 | LED1N.A 26.67,50.32 | LED0N.A 30.48,50.32
  Top 0.406: JP11.8 33.02,30.48 53.34,30.48 55.88,33.02 v55.88,34.29 58.42,36.83 58.42,41.91 62.23,45.72 62.23,46.99 63.5,48.26 66.04,48.26 66.52,48.74 LED_3V3.A | U3.IOREF 67.31,12.7 R51.2 R50.2 | R52.2 53.46,9 53.34,8.88
  Top 0.813: U1.2 53.34,8.88 54.91,8.88 v54.93,8.89
  Top 1.27: PWR_1.24 PWR_1.22 PWR_1.20 PWR_1.18 PWR_1.16 PWR_1.14 PWR_1.12 PWR_1.10 PWR_1.8 PWR_1.6 PWR_1.4 PWR_1.2
  Bottom 0.254: v31.91,46.35 31.91,47.31
  Bottom 0.406: v55.88,34.29 55.88,35.72
  Bottom 0.5: 19.05,40.64 16.99,40.64 16.51,40.16
  Bottom 0.61: U2.P$5 58.42,37.15 58.05,36.77 C5.1
  Bottom 0.813: PWR_2.2 5.08,36.83 5.08,38.73 5.71,39.37 15.72,39.37 16.51,40.16 | v54.93,8.89 56.83,10.79 56.83,13.02 57.78,13.97 U3.IOREF 78.74,13.97 PWR_1.10 | U3.3V 78.74,19.05 PWR_1.14 | 19.05,40.64 20,41.59 20,42.39 | PWR_1.22 78.74,31.75 57.78,31.75 57.15,32.38 57.15,33.87 58.05,34.77 C5.1
  Bottom 1.27: PWR_2.26 PWR_2.28 PWR_2.24 PWR_2.22 PWR_2.20 PWR_2.18 PWR_2.16 PWR_2.14 PWR_2.12 PWR_2.10 PWR_2.8 PWR_2.6 PWR_2.4 PWR_2.2 | 20,42.39 20,46.04 21.27,47.31 31.91,47.31 49.21,47.31 50.8,45.72 50.8,43.18 53.34,40.64 53.34,37.15 54.77,35.72 55.88,35.72 56.83,35.72 57.15,36.04 C5.1
+5V
  Top 0.813: VUSB.2 D1.A
  Top 1.27: PWR_1.23 79.38,36.2 78.98,36.2 78.11,37.07 78.11,37.47 IC2.OUT
  Bottom 0.813: U3.5V 82.55,21.59 | PWR_2.1 2.54,36.83 C70.1 2.22,43.18 +5V.1 | +5V.3 4.76,43.18 C10.1 5.4,43.18 +5V.5 7.3,43.18 C9.1 7.94,43.18 +5V.7 9.84,43.18 C8.1 10.48,43.18 +5V.9 12.38,43.18 C67.1 | C20.1 73.36,43.18 IC2.OUT
  Bottom 1.27: PWR_2.1 PWR_2.3 PWR_2.5 PWR_2.7 PWR_2.9 PWR_2.11 PWR_2.13 PWR_2.15 PWR_2.17 PWR_2.19 PWR_2.21 PWR_2.23 PWR_2.27 PWR_2.25 | PWR_1.1 PWR_1.3 PWR_1.5 PWR_1.7 PWR_1.9 PWR_1.11 PWR_1.13 82.55,21.59 PWR_1.15 PWR_1.17 PWR_1.19 PWR_1.21 PWR_1.23 | VUSB.2 54.61,48.9
  Bottom 1.422: +5V.1 +5V.3 +5V.5 +5V.7 +5V.9 +5V.11 15.88,45.09 15.88,47.78 16.99,48.9 54.61,48.9 66.83,48.9 68.58,47.15 68.58,44.45 69.85,43.18 IC2.OUT
BTN0
  Top 0.406: R51.1 67.31,5.71 69.22,3.81 71.12,3.81 JP38.1
  Bottom 0.406: C6.2 76.19,1.75 | 76.19,1.75 B1.P$4 | 76.19,1.75 73.18,1.75 JP38.1
BTN1
  Top 0.406: R50.1 66.04,5.4 62.71,2.06 62.41,1.77 B2.P$4
  Bottom 0.406: C11.2 62.24,1.75 B2.P$4 62.41,1.77 64.93,4.29 68.1,4.29 JP38.2
CHR0
  Bottom 0.254: IC3.15 44.41,33.7 46.35,31.75 CHR0.1
CHR1
  Bottom 0.254: IC3.14 45.31,34.7 45.72,34.29 45.72,33.66 46.35,33.02 48.26,33.02 CHR1.1
CHREN
  Bottom 0.254: IC3.13 46.09,35.2 CHREN.1
CLK/!RI
  Bottom 0.254: IC3.2 40.91,39.42 40.01,40.32 38.42,40.32 RI/CLK.1
DCD
  Bottom 0.254: IC3.1 40.41,39.12 39.69,39.85 38.1,39.85 37.31,40.64 36.2,40.64 34.92,41.91 !DCD.1
DM
  Top 0.406: X1.2 42.56,45.7 43.81,44.45 USB.2
  Bottom 0.254: IC3.5 42.41,39.58 42.39,39.61 42.39,40.4 42.39,42.39 USB.2
DP
  Top 0.406: X1.3 USB.3
  Bottom 0.254: IC3.4 41.91,43.18 USB.3
DSR
  Bottom 0.254: IC3.27 38.37,37.2 37.47,38.1 36.51,38.1 35.24,39.37 !DSR.1
EN  (via drill 0.3)
  Top 0.406: U3.RESET 64.77,15.24 64.77,5.24 63.34,3.81 57.15,3.81 55.88,5.08 55.88,9.49 55.23,10.14 53.34,10.14 | U1.3 52.55,10.14 | 52.55,10.14 v52.55,10.79 | 52.55,10.14 53.34,10.14 | R52.1 53.65,10.46 53.34,10.14
  Bottom 0.254: EN.1 52.07,29.84 50.16,27.94 36.2,27.94 35.56,28.57 35.56,29.84 34.92,30.48 31.11,30.48 29.69,29.05 29.06,29.05 T1.3
  Bottom 0.406: T1.3 29.05,25.24 27.94,24.13 27.94,11.27 28.73,10.48 52.23,10.48 v52.55,10.79 arc90 52.72,10.97 C12.1
GND  (via drill 0.3, 0.6, 1)
  Top 0.254: LED4P.C 13.06,51.07 v13.02,51.12 | LED5P.C 9.25,51.07 v9.21,51.12
  Top 0.406: X1.5 40.61,46.17 40.16,45.72 38.1,45.72 USB.5 | v41.27,40.01 41.58,40.31 C1.2 41.58,41.13 41.06,41.65 C2.2 | C7.2 45.26,41.71 C3.2 | R26.1 69.79,49.31 VCC.5
  Top 0.813: v54.29,7.62 54.28,7.61 U1.1 42.21,7.61 | 42.21,7.61 U1.38 | 42.21,7.61 U1.GND 42.21,19.03 47.61,24.43 U1.15 | C2.2 v39.85,42.23 | C3.2 v47.15,42.23
  Bottom 0.254: v41.27,40.01 41.41,39.87 IC3.3 41.41,36.7 IC3.PAD
  Bottom 0.406: 60.96,3.81 59.05,3.81 57.8,3.81 56.2,5.4 56.2,7.62
  Bottom 0.61: C4.2 59.75,41.81 59.37,41.43 U2.P$2 59.37,37.15 59.75,36.77 C5.2
  Bottom 0.813: v54.29,7.62 56.2,7.62 57.47,8.89 77.47,8.89 | U3.GND 16.89,9.91 15.88,8.89 6.35,8.89 | U3.GND2 77.47,24.13 | U3.GND1 77.47,26.67 | v39.85,42.23 39.69,42.23 37.47,44.45 USB.5 | C20.2 73.66,40.94 73.66,40.64 73.66,40.34 C21.2
  Bottom 1.422: 70.8,50.8 11.43,50.8 7.62,46.99 7.62,45.72 | 70.8,50.8 73.66,50.8 | 73.66,50.8 76.2,50.8 | 76.2,50.8 78.74,48.26 78.74,44.4 PWR.2 | VCC.5 70.8,50.8 | VCC.3 73.34,50.48 73.66,50.8 | VCC.1 75.88,50.48 76.2,50.8
  Bottom 1.676: PWR.2 77.47,40.64 73.66,40.64 IC2.GND
  other vias: 40.32,17.14 44.13,17.14 42.23,17.14 40.32,15.24 44.13,15.24 42.23,15.24 40.32,13.34 42.23,13.34 44.13,13.34 41.04,37.07 42.78,37.07 42.78,35.32 41.04,35.32 48.42,42.23 48.42,39.69 48.42,40.96 38.58,42.23 39.21,41.2 50.64,40.96 50.64,39.69 55.09,40.64 56.67,40.64 28.26,51.12 24.45,51.12 20.64,51.12 16.83,51.12
  pour Bottom (isolate 0.2): 0,52.07 83.82,52.07 83.82,0 0,0
  pour Top (isolate 0.2): 0,0 83.82,0 83.82,52.07 0,52.07
IO0_!RST
  Bottom 0.406: JP7.23 JP6.24 JP6.23 15.24,30.48 16.51,31.75 U3.D6 19.05,31.75 20.32,30.48 R31.1
IO0_!RST!_
  Top 0.406: U1.25 31.77,24.11 JP5.12 24.12,31.76 T2.3
  Bottom 0.406: R31.2 JP5.12
IO2
  Bottom 0.406: JP7.25 JP6.26 JP6.25 15.24,33.02 16.51,34.29 U3.D5 19.05,34.29 20.32,33.02 R32.1
IO2_
  Top 0.406: U1.24 32.56,25.86 31.93,25.86 31.75,26.04 26.67,31.11 25.4,32.38 JP5.13
  Bottom 0.406: R32.2 JP5.13
IO4
  Bottom 0.406: JP7.21 JP6.22 JP6.21 15.24,27.94 16.51,29.21 U3.D7 19.05,29.21 20.32,27.94 R30.1
IO4_
  Top 0.406: U1.26 30.5,22.84 JP5.11
  Bottom 0.406: R30.2 JP5.11
IO5
  Bottom 0.406: JP7.15 JP6.16 JP6.15 15.24,20.32 16.51,20.32 16.76,20.07 U3.D10 18.8,20.07 19.05,20.32 R27.1
IO5_
  Top 0.406: U1.29 30.5,19.04 29.21,20.32 JP5.8
  Bottom 0.406: R27.2 JP5.8
IO12
  Bottom 0.406: R17.1 JP2.22 JP2.21 JP3.22
IO12_
  Top 0.406: U1.14 52.05,24.11 JP1.11 63.5,35.56 63.5,36.83 U3.A2
  Bottom 0.406: R17.2 JP1.11
IO13
  Bottom 0.406: R18.1 JP2.24 JP2.23 JP3.24
IO13_
  Top 0.406: U1.16 46.34,26.66 46.99,27.3 52.7,27.3 JP1.12
  Bottom 0.406: JP1.12 60.96,33.02 | 60.96,33.02 R18.2 | U3.A0 61.75,34.29 60.96,33.5 60.96,33.02
IO14
  Bottom 0.406: R16.1 JP2.20 JP2.19 JP3.20
IO14_
  Top 0.406: U1.13 53.33,22.84 JP1.10 60.96,30.48 64.29,33.81 64.29,35.08 U3.A1
  Bottom 0.406: R16.2 JP1.10
IO15
  Bottom 0.406: JP7.27 JP6.28 JP6.27 15.24,35.56 16.51,36.83 U3.D4 19.05,36.83 20.32,35.56 R34.1
IO15_
  Top 0.406: U1.23 37.45,27.32 36.83,27.94 30.8,27.94 26.67,32.07 26.67,34.29 JP5.14
  Bottom 0.406: R34.2 JP5.14
IO16
  Bottom 0.406: JP7.19 JP6.20 JP6.19 16.51,25.4 16.76,25.15 U3.D8 18.8,25.15 19.05,25.4 R29.1
IO16_
  Top 0.406: U1.27 30.5,21.57 26.67,25.4 JP5.10
  Bottom 0.406: R29.2 JP5.10
IO17
  Bottom 0.406: JP7.17 JP6.18 JP6.17 15.24,22.86 16.51,22.86 16.76,22.61 U3.D9 18.8,22.61 19.05,22.86 R28.1
IO17_
  Top 0.406: U1.28 30.5,20.3 27.94,22.86 JP5.9
  Bottom 0.406: R28.2 JP5.9
IO18
  Bottom 0.406: JP7.13 JP6.14 JP6.13 15.24,17.78 16.51,17.78 16.76,17.53 U3.D11 18.8,17.53 19.05,17.78 R25.1
IO18_
  Top 0.406: U1.30 29.2,17.77 29.21,17.78 JP5.7
  Bottom 0.406: JP5.7 R25.2
IO19
  Bottom 0.406: JP7.11 JP6.12 JP6.11 15.24,15.24 16.51,15.24 16.76,14.99 U3.D12 18.8,14.99 19.05,15.24 R24.1
IO19_
  Top 0.406: U1.31 29.2,16.5 27.94,15.24 JP5.6
  Bottom 0.406: JP5.6 R24.2
IO21
  Bottom 0.406: JP7.9 JP6.10 JP6.9 15.24,12.7 16.51,12.7 16.76,12.45 U3.D13 18.8,12.45 19.05,12.7 R23.1
IO21_
  Top 0.406: U1.33 29.2,13.96 27.94,12.7 JP5.5
  Bottom 0.406: JP5.5 R23.2
IO22
  Top 0.406: U3.D3 19.05,38.1 19.05,6.9 18.27,6.12 16.92,6.12 16.03,5.24 15.88,5.08 JP6.3
  Bottom 0.406: JP7.3 JP6.4 JP6.3 15.88,5.08 16.92,6.12 18.11,6.12 18.64,6.12 19.68,5.08 R20.1
IO22_
  Top 0.406: U1.36 29.2,10.14 26.67,7.62 26.67,6.35 JP5.2
  Bottom 0.406: R20.2 24.45,5.08 JP5.2
IO23
  Top 0.406: U3.D2 20.32,39.37 20.32,5.2 18.67,3.55 16.89,3.55 16.19,2.86 15.88,2.54 JP6.1
  Bottom 0.406: JP7.1 JP6.2 JP6.1 15.88,2.54 16.89,3.55 18.67,3.55 19.68,2.54 R22.1
IO23_
  Top 0.406: U1.37 29.2,8.88 27.62,7.3 27.62,4.76 JP5.1
  Bottom 0.406: R22.2 JP5.1
IO25
  Bottom 0.406: R13.1 JP2.14 JP2.13 JP3.14
IO25_
  Top 0.406: U1.10 53.01,19.04 54.29,20.32 JP1.7 67.94,20.32 68.58,20.95 68.58,46.35 67.94,46.99 U3.A5
  Bottom 0.406: R13.2 JP1.7 57.15,20.32 55.88,19.05 55.88,11.11 53.34,8.57 29.84,8.57 27.94,6.67 27.94,2.54 26.67,1.27 19.37,1.27 18.35,2.29 U3.SCL
IO26
  Bottom 0.406: R14.1 JP2.16 JP2.15 JP3.16
IO26_
  Top 0.406: U1.11 53.33,20.3 55.88,22.86 JP1.8 67.31,22.86 67.94,23.5 67.94,43.81 67.31,44.45 U3.A4
  Bottom 0.406: R14.2 JP1.8 55.24,19.68 55.24,11.43 53.02,9.21 29.53,9.21 27.3,6.99 27.3,5.08 26.04,3.81 19.68,3.81 18.67,4.83 U3.SDA
IO27
  Bottom 0.406: R15.1 JP2.18 JP2.17 JP3.18
IO27_
  Top 0.406: U1.12 53.33,21.57 57.15,25.4 JP1.9 66.67,25.4 67.31,26.04 67.31,41.27 66.67,41.91 U3.A3
  Bottom 0.406: R15.2 JP1.9
IO32
  Bottom 0.406: R9.1 JP2.10 JP2.9 JP3.10
IO32_
  Top 0.406: U1.8 52.72,16.5 52.7,16.51 55.88,16.51 57.15,15.24 JP1.5
  Bottom 0.406: R9.2 JP1.5
IO33
  Bottom 0.406: R10.1 JP2.12 JP2.11 JP3.12
IO33_
  Top 0.406: U1.9 53.01,17.77 53.66,18.41 57.78,18.41 JP1.6
  Bottom 0.406: R10.2 JP1.6
IO34
  Bottom 0.406: R7.1 JP2.6 JP2.5 JP3.6
IO34_  (via drill 0.3)
  Top 0.406: U1.6 54.31,13.96 v54.29,13.97 55.24,13.97 58.42,10.79 JP1.3
  Bottom 0.406: R7.2 JP1.3 | U3.AREF 18.67,7.37 19.68,6.35 26.04,6.35 26.67,6.99 26.67,7.3 29.21,9.84 52.7,9.84 54.29,11.43 v54.29,13.97
IO35
  Bottom 0.406: R8.1 JP2.8 JP2.7 JP3.8
IO35_
  Top 0.406: JP1.4 55.9,15.22 U1.7
  Bottom 0.406: R8.2 JP1.4
LED0N
  Top 0.254: R49.2 30.16,47.94 30.48,48.26 LED0N.C
LED0P
  Top 0.254: R48.2 28.89,47.94 29.21,48.26 LED0P.A
LED1N
  Top 0.254: R43.2 27.46,47.62 26.67,48.42 LED1N.C
LED1P
  Top 0.254: R42.2 26.19,47.62 25.4,48.42 LED1P.A
LED2N
  Top 0.254: LED2N.C 22.86,49.05 23.34,48.58 24.29,48.58 24.77,48.1 R47.2
LED2P
  Top 0.254: LED2P.A 21.59,48.74 22.23,48.1 23.18,48.1 23.5,47.78 R46.2
LED3N
  Top 0.254: LED3N.C 19.05,48.74 19.68,48.1 21.59,48.1 22.07,47.62 R41.2
LED3P
  Top 0.254: LED3P.A 17.78,49.05 18.1,48.74 18.41,48.74 19.53,47.62 20.48,47.62 20.8,47.31 R40.2
LED4N
  Top 0.254: R45.2 14.34,48.48 14.61,48.74 15.08,48.74 15.24,48.9 LED4N.C
LED4P
  Top 0.254: R44.2 11.43,47.78 11.75,48.1 11.75,48.42 12.06,48.74 13.65,48.74 13.97,49.05 LED4P.A
LED5N
  Top 0.254: LED5N.C 11.43,49.05 11.11,48.74 8.89,48.74 8.73,48.9 6.51,48.9 6.35,49.05 R39.2
LED5P
  Top 0.254: LED5P.A 9.01,49.57 8.89,49.69 8.83,49.74 R38.2
LED_0
  Top 0.254: R49.1 R48.1 28.89,44.13 LEDS.6
LED_1
  Top 0.254: R43.1 R42.1 26.19,43.34 25.4,42.55 25.4,40.64 LEDS.5
LED_2
  Top 0.254: LEDS.4 24.13,42.7 | 24.13,42.7 24.77,43.34 R47.1 | R46.1 23.5,43.34 24.13,42.7
LED_3
  Top 0.254: R40.1 R41.1 22.07,43.34 22.86,42.55 22.86,40.64 LEDS.3
LED_3V3
  Top 0.406: LED_3V3.C 67.19,51.07 67.25,51.02 R26.2
LED_3V3_USB
  Top 0.406: LED_3V3_USB.C 53.23,49.57 53.66,50.01 53.76,50.11 R36.2
LED_4
  Top 0.254: R44.1 8.99,47.05 9.21,46.83 12.64,46.83 | LEDS.2 20.64,41.91 19.53,43.02 19.53,46.99 18.26,48.26 16.35,48.26 15.4,47.31 14.92,46.83 12.86,46.83 12.64,46.83 | R45.1 12.64,46.83
LED_5  (via drill 0.3)
  Top 0.254: LEDS.1 19.05,41.91 19.05,42.7 v18.57,43.18 | R39.1 R38.1 7.62,45.09 v7.62,41.91
  Bottom 0.254: v18.57,43.18 15.88,43.18 14.61,41.91 v7.62,41.91
N$2
  Bottom 0.254: IC3.23 38.53,35.2 37.62,34.29 !CTS.1
N$4
  Top 0.406: LED3.C R3.2
N$31
  Top 0.813: SERVOS.1 SERVOS.2
N$32
  Top 0.813: SERVOS.3 SERVOS.4
N$33
  Top 0.813: SERVOS.5 SERVOS.6
N$34
  Top 0.813: SERVOS.7 SERVOS.8
N$35
  Top 0.813: SERVOS.9 SERVOS.10
N$36
  Top 0.813: SERVOS.11 SERVOS.12
NC-CS
  Top 0.406: U1.19 42.53,27.29 JP11.3
NC-HOLD
  Top 0.406: U1.17 45.07,26.97 46.04,27.94 48.9,27.94 49.53,28.57 JP11.1
NC-MISO
  Top 0.406: U1.22 38.72,27.32 JP11.6
NC-MOSI
  Top 0.406: U1.21 39.99,28.59 JP11.5
NC-SCK
  Top 0.406: U1.20 41.26,28.56 JP11.4
NC-WP
  Top 0.406: U1.18 43.8,26.66 45.4,28.26 45.72,28.57 46.35,29.21 JP11.2
RX-LED
  Top 0.406: LED2.C R2.1
RX_LED
  Top 0.406: R2.2 34.92,44.45 33.66,43.18 33.02,43.18 32.38,43.18 31.11,43.18 30.48,42.55 30.48,38.73 31.11,38.1 32.23,38.1 33.02,37.31 33.02,36.2 33.66,35.56 34.77,35.56 35.56,34.77 35.56,34.29 35.56,33.66 36.2,33.02 38.97,33.02 40.64,33.02 IO1/RXLED.1
  Bottom 0.254: IC3.18 IO1/RXLED.1
RXD
  Bottom 0.254: IC3.25 37.78,36.2 37.39,35.8 35.32,35.8 34.29,35.8 | R12.1 29.11,34.19 30.24,35.32 32.94,35.32 33.42,35.8 34.29,35.8 | 34.29,35.8 RXD.1
RXD0
  Top 0.406: JP6.7 15.24,11.43 15.24,43.18 16.35,44.29 16.35,45.56 U3.D0
  Bottom 0.406: JP7.7 JP6.8 JP6.7 15.88,10.16 16.91,11.19 18.65,11.19 19.68,10.16 R33.1
RXD0_
  Top 0.406: U1.34 29.2,12.69 26.67,10.16 JP5.4
  Bottom 0.406: R33.2 JP5.4 26.67,11.43 26.67,24.77 26.99,25.08 R11.2
SENSOR_VN
  Bottom 0.406: R6.1 JP2.4 JP2.3 JP3.4
SENSOR_VN_
  Top 0.406: JP1.2 57.15,8.89 57.15,10.79 55.26,12.69 U1.5
  Bottom 0.406: R6.2 JP1.2
SENSOR_VP
  Bottom 0.406: R19.1 JP2.2 JP2.1 JP3.2
SENSOR_VP_
  Top 0.406: JP1.1 56.52,6.99 56.52,10.16 54.93,11.75 52.39,11.75 52.05,11.41 U1.4
  Bottom 0.406: R19.2 JP1.1
SUSPEND
  Top 0.406: SUSPEND.1 48.26,35.56 48.26,37.47 49.53,38.73 R3.1
  Bottom 0.254: IC3.12 46.22,35.7 46.35,35.56 48.26,35.56 SUSPEND.1
TX-LED
  Top 0.406: LED1.C R1.1
TX_LED
  Top 0.406: R1.2 33.02,44.45 32.38,43.81 29.53,43.81 27.94,42.23 27.94,36.35 28.73,35.56 32.38,35.56 33.02,34.92 33.02,33.58 33.58,33.02 34.92,33.02 36.2,31.75 IO0/TXLED.1
  Bottom 0.254: IC3.19 41.41,32.76 40.64,31.99 40.64,31.11 40.24,30.72 37.86,30.72 IO0/TXLED.1
TXD
  Bottom 0.254: R11.1 26.99,28.26 26.51,28.73 26.51,35.08 26.51,35.24 26.99,35.72 29.69,35.72 29.77,35.8 32.31,35.8 33.02,36.51 33.02,37.31 33.81,38.1 35.56,38.1 TXD.1 36.97,36.7 IC3.26
TXD0
  Top 0.406: U3.D1 16.51,43.18 16.51,8.89 15.24,7.62 JP6.5
  Bottom 0.406: JP7.5 JP6.6 JP6.5 15.88,7.62 16.91,8.65 18.65,8.65 19.68,7.62 R21.1
TXD0_
  Top 0.406: U1.35 29.2,11.41 JP5.3
  Bottom 0.406: R12.2 27.41,32.33 27.15,32.07 27.15,29.53 27.94,28.73 27.94,25.08 27.3,24.45 27.3,9.53 JP5.3 R21.2
USBID
  Top 0.406: X1.4 41.26,45.7 40.01,44.45 USB.4
USBIO3_RS485
  Bottom 0.254: IC3.17 42.41,32.84 43.02,32.23 43.02,31.27 41.99,30.24 37.07,30.24 36.75,30.24 35.24,31.75 IO2/RS485.1
USBIO3_WAKEUP
  Bottom 0.254: IC3.16 42.91,32.97 44.13,31.75 IO3/WAKEUP.1
USBIO4
  Bottom 0.254: IC3.22 38.74,34.7 37.31,33.26 35.32,33.26 IO4.1
USBIO5
  Bottom 0.254: IC3.21 40.41,33.11 40.08,32.78 32.78,32.78 IO5.1
USBIO6
  Bottom 0.254: IC3.20 40.91,32.97 39.69,31.75 IO6.1
VCC
  Top 1.422: VCC.2 VCC.4 | VCC.4 VCC.6 | PWR.1 73.34,44.72 VCC.4
  Bottom 1.676: D5.A 78.12,38.08 PWR.1
VCC->5V
  Bottom 0.813: C21.1 73.66,38.4 73.66,38.1
  Bottom 1.676: IC2.IN 73.66,38.1 D5.C
VCCIO  (via drill 0.3)
  Top 0.406: v43.02,40.01 42.88,40.15 C1.1 42.88,41.42 42.76,41.54 C2.1 42.76,42.81 42.39,43.18 35.56,43.18 | LED1.A LED2.A 35.84,51.07 36.43,50.48 36.43,46.04 | LED_3V3_USB.A LED3.A 48.85,51.07 48.26,50.48 v48.26,46.04 | 35.56,43.18 35.56,45.16 36.43,46.04 | 35.56,43.18 35.56,41.27 34.92,40.64 33.81,40.64 32.54,39.37 VCCIO.4 VCCIO.2 | v36.75,46.04 36.43,46.04
  Bottom 0.254: IC3.6 42.91,39.89 v43.02,40.01 43.02,40.16 43.55,40.7 R35.2
  Bottom 0.406: v48.26,46.04 v36.75,46.04 | VCCIO.6 VCCIO.4
VUSB  (via drill 0.3)
  Top 0.406: X1.1 43.21,46.17 43.66,45.72 45.72,45.72 USB.1 45.72,43.18 44.45,43.18 44.08,42.81 C3.1 44.08,41.54 43.97,41.43 43.96,41.42 C7.1 v43.96,40.02 v43.97,40.01
  Bottom 0.254: IC3.7 43.41,39.28 43.97,39.85 v43.97,40.01 45.24,38.73 45.24,37.94 45,37.7 IC3.8
  Bottom 0.813: D2.A USB.1
(copper drawn outside any net)
  shapes: Bottom area x1380

### Text on the board
Top: + - | RB 3-17 | RB3200-ESP32universal v2.1
Bottom: github:roboticsbrno/ / RB3200-ESP32universal / CC BY-SA 4.0 / v2.1
tPlace: LED_3V3 | 5 | LED_3V3_USB | 4 | 3 | 2 | 1 | 0 | TX | RX | 0 | G / 5 / S / S | !SHDN | 5 | + - | 5V_USB | 1 | 4 / 2 / 0 | 4 | 2 | 3 | 3 | 2 | 4 | 5 / 3 / 1 | IO15 | 1 | 5 | S / S / S / G / 3 / 5 | IO2 | IO13 | 0 | 6 | IO0 | 7 | IO12 | IO4 | + | - | I | O | C | S | W | H | IO14 | Vin | 8 | IO16 | IO27 | Gnd | 9 | IO17 | IO26 | 10 | IO5 | 5V | IO25 | 11 | IO18 | 3V | IO33 | 12 | IO19 | IO32 | RST | 13 | ROBOTARNA | IO21 | IOr | IO35 | GND | RXD | IO34 | NC | TXD | SDA | SVN | ARef | IO22 | SVP | SCL | IO23 | RB3200-ESP32universal v2.1 | RB 3-17 | RB RobotikaBrno.cz | github:roboticsbrno/ / RB3200-ESP32universal / CC BY-SA 4.0 | 5 / 3 / G / S / S / S
Document: Released under the Creative Commons Attribution-ShareAlike 4.0 License / https://creativecommons.org/licenses/by-sa/4.0/ / Designed by: JM & JP & JS & JV & RobotikaBrno / / RB3200-ESP32universal / https://github.com/RoboticsBrno/RB3200-ESP32universal / / RobotikaBrno.cz / Robotarna
bSilk: + - | S / S / S / G / 3 / 5 | RB RobotikaBrno.cz / github:roboticsbrno/ / RB3200-ESP32universal v2.1 / CC BY-SA 4.0